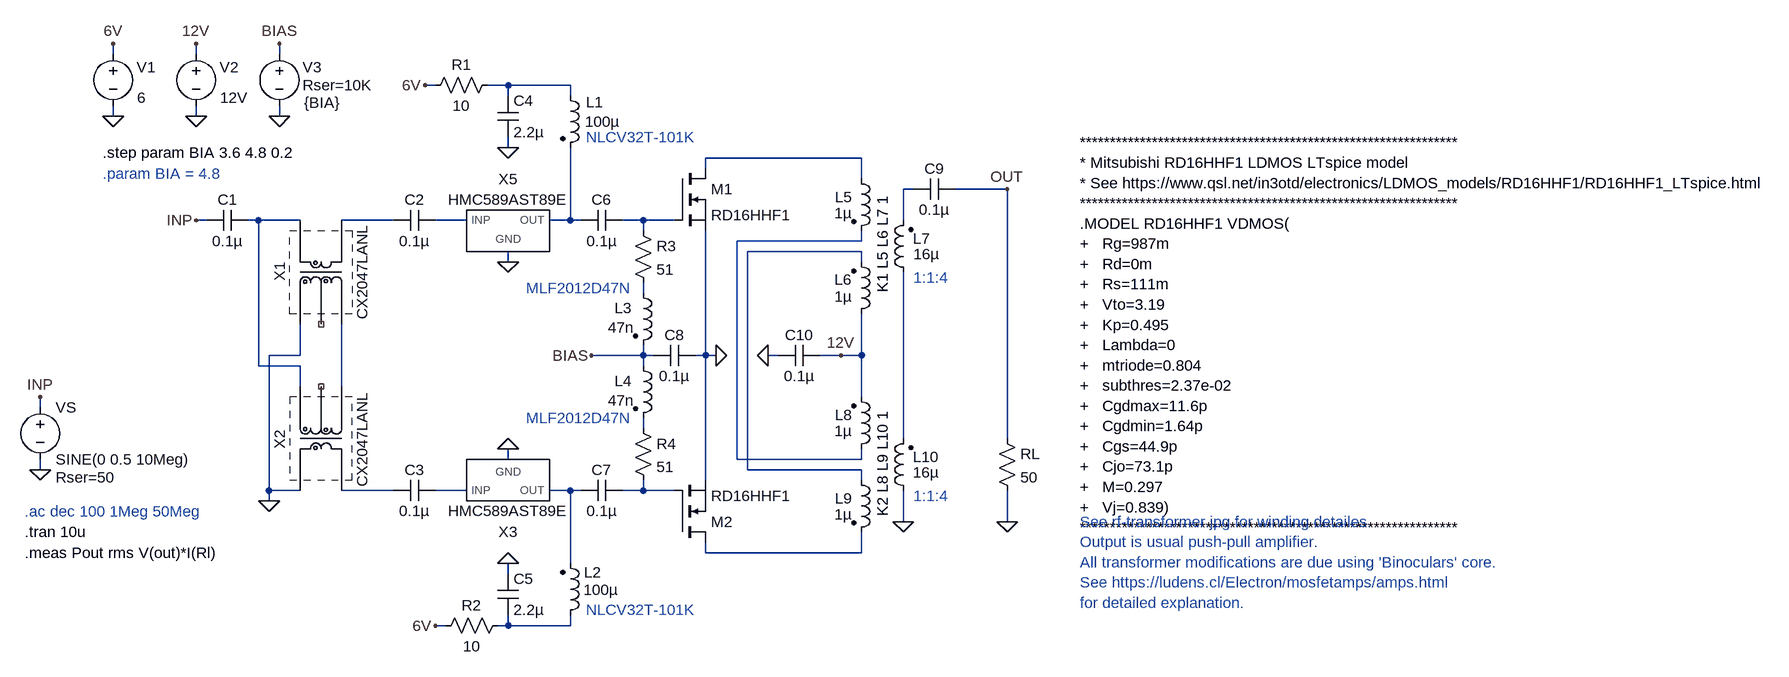
[diagram p0: schematic pwr-amp.asc]
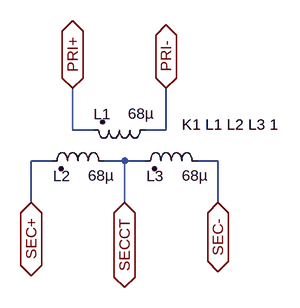
[diagram p1: sub-circuit cx2047lanl.asc]
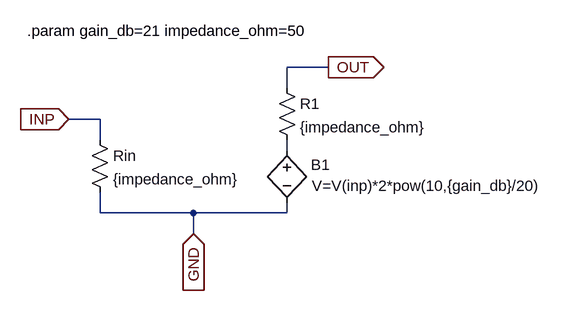
[diagram p2: sub-circuit hmc589ast89e.asc]
pwr-amp.asc, the LTspice schematic file:
Version 4
SHEET 1 2784 1036
WIRE -256 -176 -256 -192
WIRE -128 -176 -128 -192
WIRE 0 -176 0 -192
WIRE 240 -128 224 -128
WIRE 352 -128 320 -128
WIRE 448 -128 352 -128
WIRE 352 -112 352 -128
WIRE 448 -112 448 -128
WIRE -256 -80 -256 -96
WIRE -128 -80 -128 -96
WIRE 0 -80 0 -96
WIRE 352 -32 352 -48
WIRE 896 -16 656 -16
WIRE 656 0 656 -16
WIRE 896 16 896 -16
WIRE 976 32 960 32
WIRE 1120 32 1040 32
WIRE -112 80 -128 80
WIRE -32 80 -48 80
WIRE 32 80 -32 80
WIRE 176 80 96 80
WIRE 288 80 240 80
WIRE 448 80 448 -32
WIRE 448 80 416 80
WIRE 464 80 448 80
WIRE 560 80 528 80
WIRE 608 80 560 80
WIRE 960 80 960 32
WIRE 560 96 560 80
WIRE 896 112 896 96
WIRE 896 112 704 112
WIRE 896 128 720 128
WIRE 352 144 352 128
WIRE 896 144 896 128
WIRE 560 192 560 176
WIRE 32 288 32 240
WIRE 32 288 -16 288
WIRE 560 288 560 272
WIRE 560 288 480 288
WIRE 576 288 560 288
WIRE 656 288 656 96
WIRE 656 288 640 288
WIRE 672 288 656 288
WIRE 768 288 752 288
WIRE 864 288 832 288
WIRE 896 288 896 224
WIRE 896 288 864 288
WIRE -32 304 -32 80
WIRE 32 304 -32 304
WIRE 560 304 560 288
WIRE 32 336 32 304
WIRE 96 336 96 240
WIRE 896 352 896 288
WIRE -368 368 -368 352
WIRE 560 400 560 384
WIRE 960 416 960 160
WIRE 1120 416 1120 32
WIRE 352 448 352 432
WIRE 704 448 704 112
WIRE 896 448 896 432
WIRE 896 448 704 448
WIRE -368 464 -368 448
WIRE 720 464 720 128
WIRE 896 464 720 464
WIRE 656 480 656 288
WIRE 896 480 896 464
WIRE -16 496 -16 288
WIRE 32 496 -16 496
WIRE 176 496 96 496
WIRE 288 496 240 496
WIRE 448 496 416 496
WIRE 464 496 448 496
WIRE 560 496 560 480
WIRE 560 496 528 496
WIRE 608 496 560 496
WIRE -16 512 -16 496
WIRE 960 544 960 496
WIRE 1120 544 1120 496
WIRE 656 592 656 576
WIRE 896 592 896 560
WIRE 896 592 656 592
WIRE 448 608 448 496
WIRE 352 624 352 608
WIRE 256 704 240 704
WIRE 352 704 352 688
WIRE 352 704 336 704
WIRE 448 704 448 688
WIRE 448 704 352 704
FLAG -16 512 0
FLAG -128 80 INP
FLAG -368 464 0
FLAG -368 352 INP
FLAG 352 144 0
FLAG 352 432 0
FLAG 352 -32 0
FLAG 224 -128 6V
FLAG 352 608 0
FLAG 240 704 6V
FLAG -256 -80 0
FLAG -256 -192 6V
FLAG 0 -80 0
FLAG 0 -192 BIAS
FLAG -128 -80 0
FLAG -128 -192 12V
FLAG 480 288 BIAS
FLAG 672 288 0
FLAG 1120 544 0
FLAG 1120 32 OUT
FLAG 960 544 0
FLAG 752 288 0
FLAG 864 288 12V
SYMBOL voltage -368 352 R0
WINDOW 123 0 0 Left 0
WINDOW 39 24 124 Left 2
SYMATTR SpiceLine Rser=50
SYMATTR InstName VS
SYMATTR Value SINE(0 0.5 10Meg)
SYMBOL cap 240 64 R90
WINDOW 0 0 32 VBottom 2
WINDOW 3 32 32 VTop 2
SYMATTR InstName C2
SYMATTR Value 0.1µ
SYMBOL cap 240 480 R90
WINDOW 0 0 32 VBottom 2
WINDOW 3 32 32 VTop 2
SYMATTR InstName C3
SYMATTR Value 0.1µ
SYMBOL ind2 432 -128 R0
WINDOW 0 40 26 Left 2
WINDOW 3 38 56 Left 2
SYMATTR InstName L1
SYMATTR Value 100µ
SYMATTR SpiceLine Ipk=120m Rser=3.7 Rpar=56K Cpar=1.544p
SYMATTR Type ind
SYMBOL cap 336 -112 R0
SYMATTR InstName C4
SYMATTR Value 2.2µ
SYMBOL res 336 -144 R90
WINDOW 0 0 56 VBottom 2
WINDOW 3 32 56 VTop 2
SYMATTR InstName R1
SYMATTR Value 10
SYMBOL cap 336 688 M180
WINDOW 0 24 56 Left 2
WINDOW 3 24 8 Left 2
SYMATTR InstName C5
SYMATTR Value 2.2µ
SYMBOL res 352 688 R90
WINDOW 0 0 56 VBottom 2
WINDOW 3 32 56 VTop 2
SYMATTR InstName R2
SYMATTR Value 10
SYMBOL voltage -256 -192 R0
WINDOW 123 0 0 Left 0
WINDOW 39 0 0 Left 0
WINDOW 0 36 36 Left 2
WINDOW 3 37 83 Left 2
SYMATTR InstName V1
SYMATTR Value 6
SYMBOL cap 528 64 R90
WINDOW 0 0 32 VBottom 2
WINDOW 3 32 32 VTop 2
SYMATTR InstName C6
SYMATTR Value 0.1µ
SYMBOL cap 528 480 R90
WINDOW 0 0 32 VBottom 2
WINDOW 3 32 32 VTop 2
SYMATTR InstName C7
SYMATTR Value 0.1µ
SYMBOL ind2 432 704 M180
WINDOW 0 37 82 Left 2
WINDOW 3 36 55 Left 2
SYMATTR InstName L2
SYMATTR Value 100µ
SYMATTR SpiceLine Ipk=120m Rser=3.7 Rpar=56K Cpar=1.544p
SYMATTR Type ind
SYMBOL cap -48 64 R90
WINDOW 0 0 32 VBottom 2
WINDOW 3 32 32 VTop 2
SYMATTR InstName C1
SYMATTR Value 0.1µ
SYMBOL CX2047LANL 64 160 R270
SYMATTR InstName X1
SYMBOL CX2047LANL 64 416 M90
SYMATTR InstName X2
SYMBOL HMC589AST89E 352 96 R0
SYMATTR InstName X5
SYMBOL HMC589AST89E 352 480 M180
SYMATTR InstName X3
SYMBOL voltage 0 -192 R0
WINDOW 123 0 0 Left 0
WINDOW 39 36 64 Left 2
WINDOW 0 36 36 Left 2
WINDOW 3 38 91 Left 2
SYMATTR SpiceLine Rser=10K
SYMATTR InstName V3
SYMATTR Value {BIA}
SYMBOL nmos 608 0 R0
SYMATTR InstName M1
SYMATTR Value RD16HHF1
SYMBOL voltage -128 -192 R0
WINDOW 123 0 0 Left 0
WINDOW 39 0 0 Left 0
WINDOW 0 36 36 Left 2
WINDOW 3 37 83 Left 2
SYMATTR InstName V2
SYMATTR Value 12V
SYMBOL nmos 608 576 M180
SYMATTR InstName M2
SYMATTR Value RD16HHF1
SYMBOL cap 640 272 R90
WINDOW 0 0 32 VBottom 2
WINDOW 3 32 32 VTop 2
SYMATTR InstName C8
SYMATTR Value 0.1µ
SYMBOL res 544 80 R0
SYMATTR InstName R3
SYMATTR Value 51
SYMBOL res 544 384 R0
SYMATTR InstName R4
SYMATTR Value 51
SYMBOL ind2 880 448 M180
WINDOW 0 2 68 Right 2
WINDOW 3 1 44 Right 2
SYMATTR InstName L8
SYMATTR Value 1µ
SYMATTR Type ind
SYMBOL ind2 880 464 R0
WINDOW 0 2 44 Right 2
WINDOW 3 1 69 Right 2
SYMATTR InstName L9
SYMATTR Value 1µ
SYMATTR Type ind
SYMBOL ind2 976 512 R180
WINDOW 0 1 68 Right 2
WINDOW 3 1 44 Right 2
SYMATTR InstName L10
SYMATTR Value 16µ
SYMATTR Type ind
SYMBOL cap 1040 16 R90
WINDOW 0 0 32 VBottom 2
WINDOW 3 32 32 VTop 2
SYMATTR InstName C9
SYMATTR Value 0.1µ
SYMBOL res 1104 400 R0
SYMATTR InstName RL
SYMATTR Value 50
SYMBOL ind2 544 176 R0
WINDOW 0 -1 39 Right 2
WINDOW 3 2 69 Right 2
SYMATTR InstName L3
SYMATTR Value 47n
SYMATTR SpiceLine Ipk=300m Rser=0.05 Rpar=230 Cpar=1.1p
SYMATTR Type ind
SYMBOL ind2 544 288 R0
WINDOW 0 -1 39 Right 2
WINDOW 3 2 69 Right 2
SYMATTR InstName L4
SYMATTR Value 47n
SYMATTR SpiceLine Ipk=300m Rser=0.05 Rpar=230 Cpar=1.1p
SYMATTR Type ind
SYMBOL ind2 976 176 R180
WINDOW 0 1 68 Right 2
WINDOW 3 0 44 Right 2
SYMATTR InstName L7
SYMATTR Value 16µ
SYMATTR Type ind
SYMBOL ind2 880 0 R0
WINDOW 0 2 44 Right 2
WINDOW 3 1 69 Right 2
SYMATTR InstName L5
SYMATTR Value 1µ
SYMATTR Type ind
SYMBOL ind2 880 240 M180
WINDOW 0 1 69 Right 2
WINDOW 3 1 43 Right 2
SYMATTR InstName L6
SYMATTR Value 1µ
SYMATTR Type ind
SYMBOL cap 832 272 R90
WINDOW 0 0 32 VBottom 2
WINDOW 3 32 32 VTop 2
SYMATTR InstName C10
SYMATTR Value 0.1µ
TEXT -392 528 Left 2 ;.ac dec 100 1Meg 50Meg
TEXT -392 560 Left 2 !.tran 10u
TEXT 472 -48 Left 2 ;NLCV32T-101K
TEXT 472 680 Left 2 ;NLCV32T-101K
TEXT 1232 -40 Left 2 !***************************************************************\n* Mitsubishi RD16HHF1 LDMOS LTspice model\n* See https://www.qsl.net/in3otd/electronics/LDMOS_models/RD16HHF1/RD16HHF1_LTspice.html\n***************************************************************\n.MODEL RD16HHF1 VDMOS(\n+   Rg=987m\n+   Rd=0m\n+   Rs=111m\n+   Vto=3.19\n+   Kp=0.495\n+   Lambda=0\n+   mtriode=0.804\n+   subthres=2.37e-02\n+   Cgdmax=11.6p\n+   Cgdmin=1.64p\n+   Cgs=44.9p\n+   Cjo=73.1p\n+   M=0.297\n+   Vj=0.839)\n***************************************************************
TEXT 928 192 VLeft 2 !K1 L5 L6 L7 1
TEXT -272 -24 Left 2 !.step param BIA 3.6 4.8 0.2
TEXT 544 184 Right 2 ;MLF2012D47N
TEXT 544 384 Right 2 ;MLF2012D47N
TEXT -392 592 Left 2 !.meas Pout rms V(out)*I(Rl)
TEXT 928 536 VLeft 2 !K2 L8 L9 L10 1
TEXT 976 168 Left 2 ;1:1:4
TEXT 976 504 Left 2 ;1:1:4
TEXT -272 8 Left 2 ;.param BIA = 4.8
TEXT 1232 544 Left 2 ;See rf-transformer.jpg for winding detailes.\nOutput is usual push-pull amplifier.\nAll transformer modifications are due using 'Binoculars' core.\nSee https://ludens.cl/Electron/mosfetamps/amps.html\nfor detailed explanation.

cx2047lanl.asc, the sub-circuit schematic file:
Version 4
SHEET 1 880 680
WIRE 16 112 16 48
WIRE 48 112 16 112
WIRE 160 112 160 48
WIRE 160 112 128 112
WIRE -16 160 -48 160
WIRE 96 160 64 160
WIRE 128 160 96 160
WIRE 240 160 208 160
WIRE -48 224 -48 160
WIRE 96 224 96 160
WIRE 240 224 240 160
FLAG 16 48 PRI+
IOPIN 16 48 BiDir
FLAG 160 48 PRI-
IOPIN 160 48 BiDir
FLAG 96 224 SECCT
IOPIN 96 224 BiDir
FLAG 240 224 SEC-
IOPIN 240 224 BiDir
FLAG -48 224 SEC+
IOPIN -48 224 BiDir
SYMBOL ind2 144 96 R90
WINDOW 0 -8 69 VRight 2
WINDOW 3 -9 43 VLeft 2
SYMATTR InstName L1
SYMATTR Value 68µ
SYMATTR Type ind
SYMBOL ind2 80 176 M270
WINDOW 0 -7 67 VRight 2
WINDOW 3 -6 40 VLeft 2
SYMATTR InstName L2
SYMATTR Value 68µ
SYMATTR Type ind
SYMBOL ind2 224 176 M270
WINDOW 0 -7 67 VRight 2
WINDOW 3 -6 40 VLeft 2
SYMATTR InstName L3
SYMATTR Value 68µ
SYMATTR Type ind
TEXT 184 104 Left 2 !K1 L1 L2 L3 1

hmc589ast89e.asc, the sub-circuit schematic file:
Version 4
SHEET 1 956 680
WIRE 240 16 176 16
WIRE 176 48 176 16
WIRE -112 96 -160 96
WIRE -112 128 -112 96
WIRE 176 144 176 128
WIRE -112 240 -112 208
WIRE 32 240 -112 240
WIRE 176 240 176 224
WIRE 176 240 32 240
WIRE 32 272 32 240
FLAG -160 96 INP
IOPIN -160 96 In
FLAG 32 272 GND
IOPIN 32 272 In
FLAG 240 16 OUT
IOPIN 240 16 Out
SYMBOL res -128 112 R0
SYMATTR InstName Rin
SYMATTR Value {impedance_ohm}
SYMBOL bv 176 128 R0
WINDOW 0 37 38 Left 2
WINDOW 3 38 70 Left 2
SYMATTR InstName B1
SYMATTR Value V=V(inp)*2*pow(10,{gain_db}/20)
SYMBOL res 160 32 R0
SYMATTR InstName R1
SYMATTR Value {impedance_ohm}
TEXT -224 -40 Left 2 !.param gain_db=21 impedance_ohm=50

The netlist it stands for:
* pwr-amp.asc
VS INP 0 SINE(0 0.5 10Meg) Rser=50
C2 N006 N005 0.1µ
C3 N016 N015 0.1µ
L1 N001 N007 100µ Ipk=120m Rser=3.7 Rpar=56K Cpar=1.544p
C4 N001 0 2.2µ
R1 N001 6V 10
C5 N020 0 2.2µ
R2 N020 6V 10
V1 6V 0 6
C6 N008 N007 0.1µ
C7 N018 N017 0.1µ
L2 N020 N017 100µ Ipk=120m Rser=3.7 Rpar=56K Cpar=1.544p
C1 N004 INP 0.1µ
XX1 0 NC_01 N012 N004 N005 cx2047lanl params: CX2047LANL
XX2 N004 NC_02 N012 0 N015 cx2047lanl params: CX2047LANL
XX5 N006 0 N007 hmc589ast89e params: HMC589AST89E
XX3 N016 0 N017 hmc589ast89e params: HMC589AST89E
V3 BIAS 0 {BIA} Rser=10K
M1 N002 N008 0 0 RD16HHF1
V2 12V 0 12V
M2 N019 N018 0 0 RD16HHF1
C8 0 BIAS 0.1µ
R3 N008 N011 51
R4 N013 N018 51
L8 N009 12V 1µ
L9 N010 N019 1µ
L10 0 N014 16µ
C9 OUT N003 0.1µ
RL OUT 0 50
L3 N011 BIAS 47n Ipk=300m Rser=0.05 Rpar=230 Cpar=1.1p
L4 BIAS N013 47n Ipk=300m Rser=0.05 Rpar=230 Cpar=1.1p
L7 N014 N003 16µ
L5 N002 N009 1µ
L6 12V N010 1µ
C10 12V 0 0.1µ

* block symbol definitions
.subckt cx2047lanl SEC+ SECCT SEC- PRI+ PRI-
L1 PRI- PRI+ 68µ
L2 SECCT SEC+ 68µ
L3 SEC- SECCT 68µ
K1 L1 L2 L3 1
.ends cx2047lanl

.subckt hmc589ast89e INP GND OUT
Rin INP GND {impedance_ohm}
B1 N001 GND V=V(inp)*2*pow(10,{gain_db}/20)
R1 OUT N001 {impedance_ohm}
.param gain_db=21 impedance_ohm=50
.ends hmc589ast89e

.model NMOS NMOS
.model PMOS PMOS
.lib standard.mos
* .ac dec 100 1Meg 50Meg
.tran 10u
* NLCV32T-101K
* NLCV32T-101K
***************************************************************
* Mitsubishi RD16HHF1 LDMOS LTspice model
* See https://www.qsl.net/in3otd/electronics/LDMOS_models/RD16HHF1/RD16HHF1_LTspice.html
***************************************************************
.MODEL RD16HHF1 VDMOS(
+   Rg=987m
+   Rd=0m
+   Rs=111m
+   Vto=3.19
+   Kp=0.495
+   Lambda=0
+   mtriode=0.804
+   subthres=2.37e-02
+   Cgdmax=11.6p
+   Cgdmin=1.64p
+   Cgs=44.9p
+   Cjo=73.1p
+   M=0.297
+   Vj=0.839)
***************************************************************
K1 L5 L6 L7 1
.step param BIA 3.6 4.8 0.2
* MLF2012D47N
* MLF2012D47N
.meas Pout rms V(out)*I(Rl)
K2 L8 L9 L10 1
* 1:1:4
* 1:1:4
* .param BIA = 4.8
* See rf-transformer.jpg for winding detailes.
* Output is usual push-pull amplifier.
* All transformer modifications are due using 'Binoculars' core.
* See https://ludens.cl/Electron/mosfetamps/amps.html
* for detailed explanation.
.backanno
.end